# EAGLE design gigafoc (EAGLE 9.6.2)
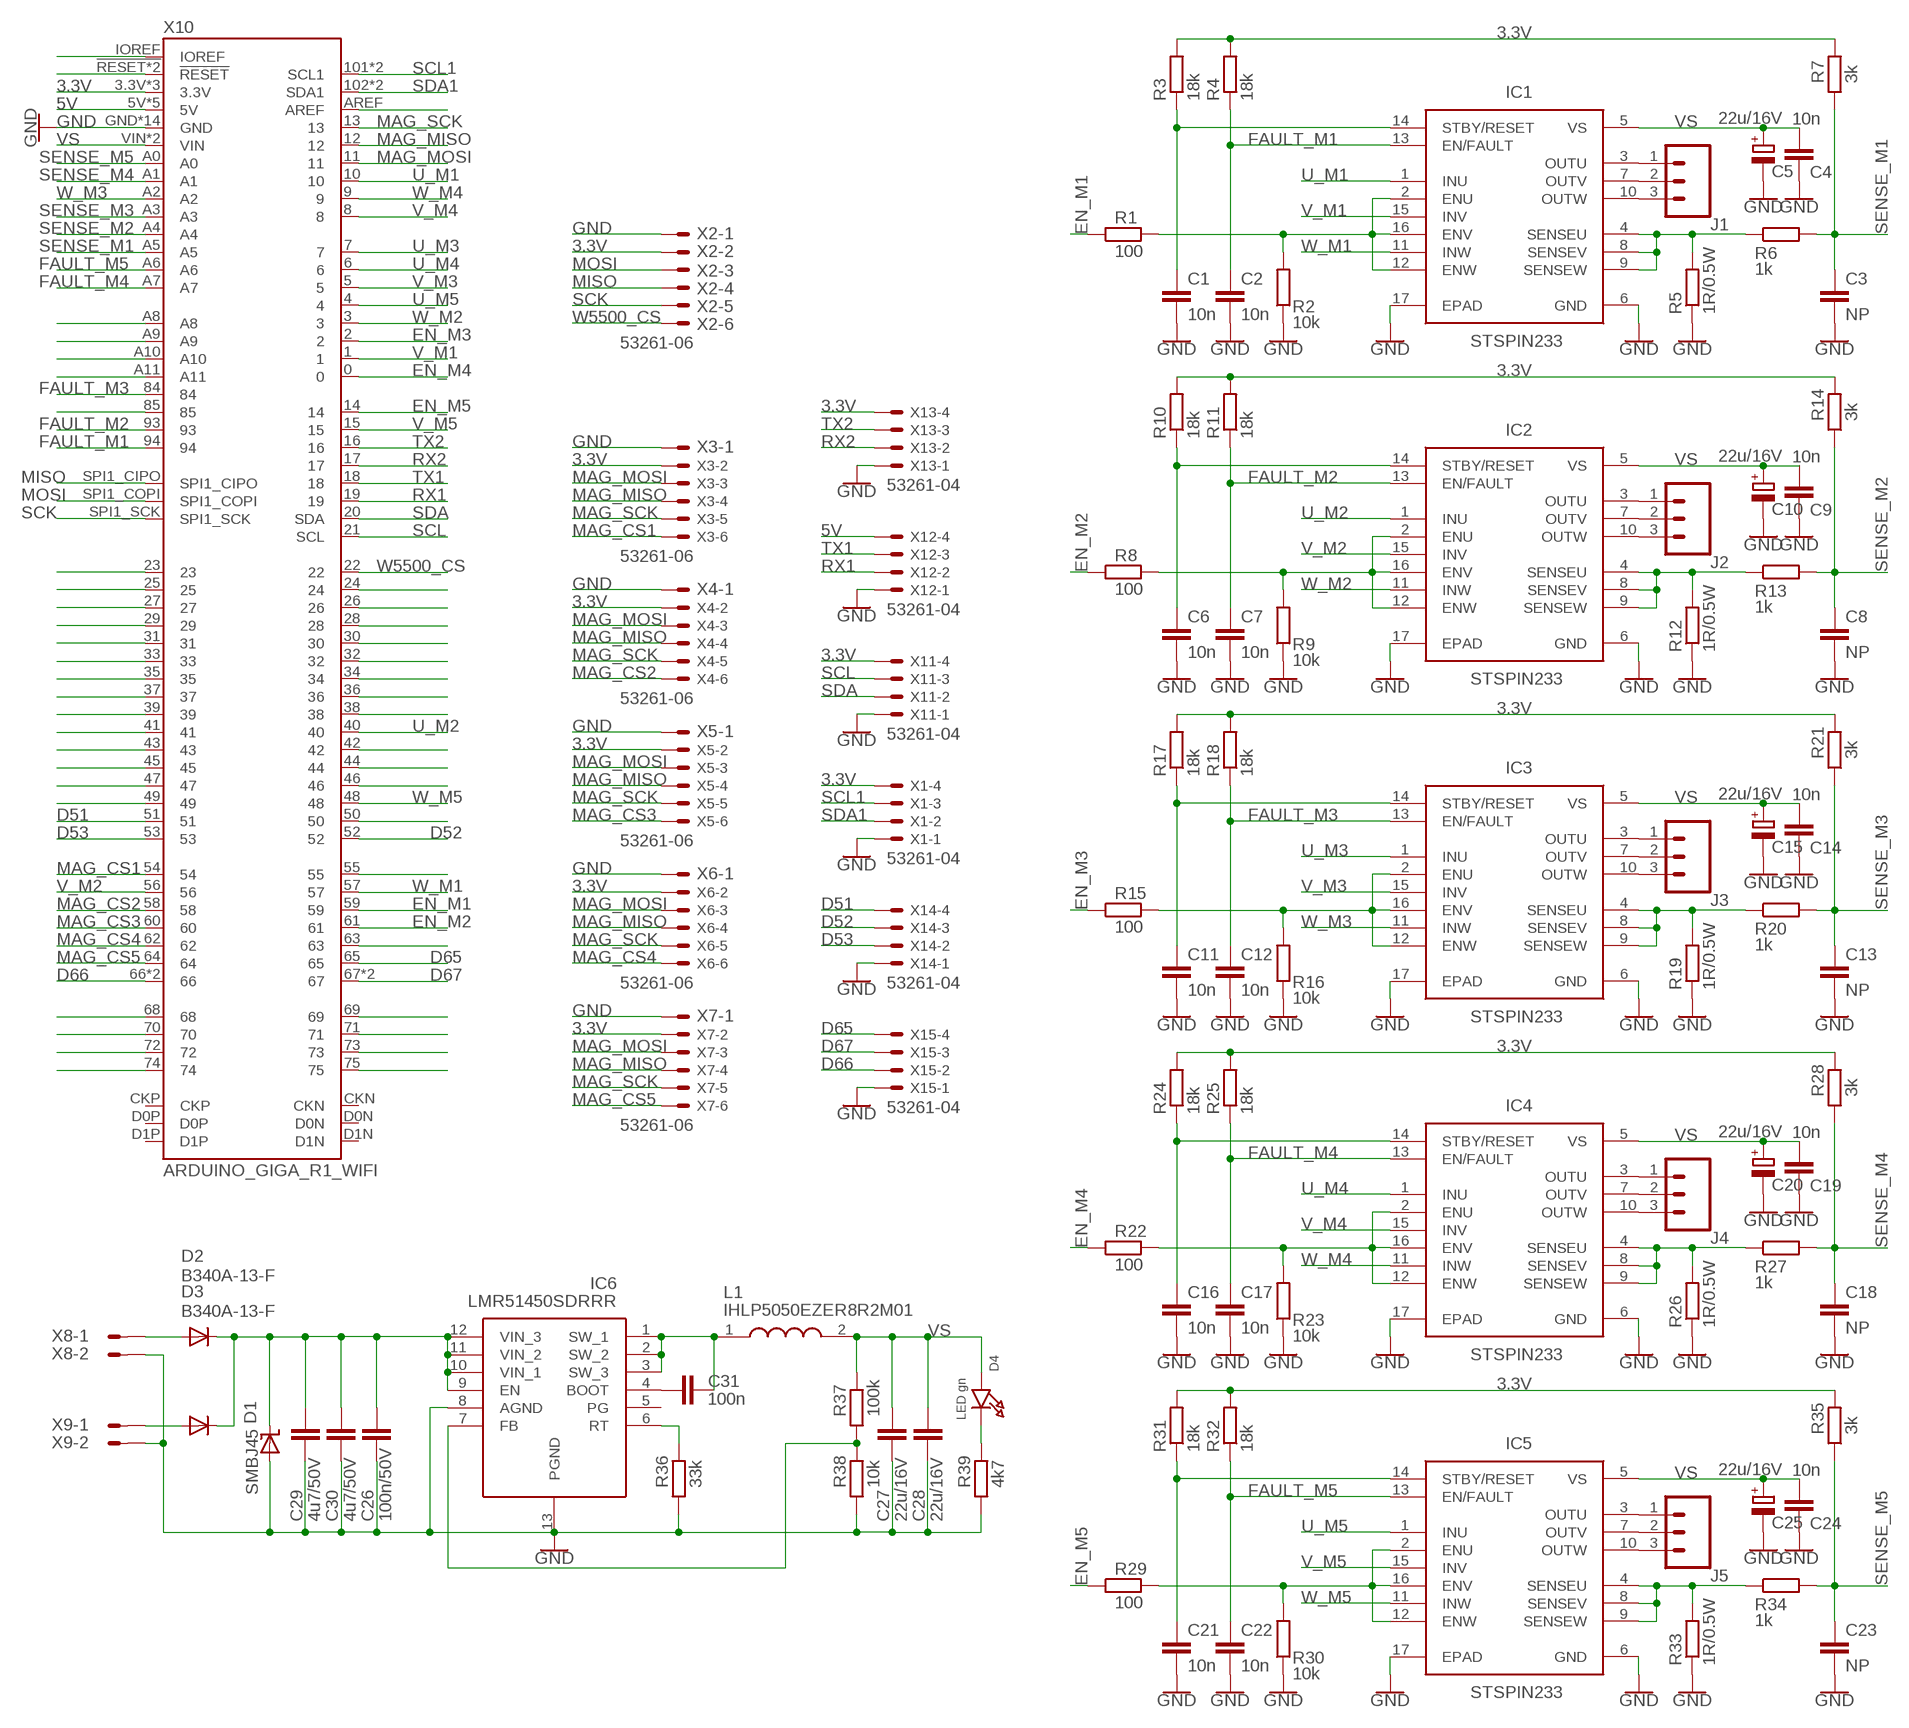
[diagram p0: schematic, sheet 1]

## Parts
C1  10n  C-EUC0603  [C0603]
C2  10n  C-EUC0603  [C0603]
C3  NP  C-EUC0603  [C0603]
C4  10n  C-EUC0603  [C0603]
C5  22u/16V  CPOL-EUSMCB  [SMC_B]
C6  10n  C-EUC0603  [C0603]
C7  10n  C-EUC0603  [C0603]
C8  NP  C-EUC0603  [C0603]
C9  10n  C-EUC0603  [C0603]
C10  22u/16V  CPOL-EUSMCB  [SMC_B]
C11  10n  C-EUC0603  [C0603]
C12  10n  C-EUC0603  [C0603]
C13  NP  C-EUC0603  [C0603]
C14  10n  C-EUC0603  [C0603]
C15  22u/16V  CPOL-EUSMCB  [SMC_B]
C16  10n  C-EUC0603  [C0603]
C17  10n  C-EUC0603  [C0603]
C18  NP  C-EUC0603  [C0603]
C19  10n  C-EUC0603  [C0603]
C20  22u/16V  CPOL-EUSMCB  [SMC_B]
C21  10n  C-EUC0603  [C0603]
C22  10n  C-EUC0603  [C0603]
C23  NP  C-EUC0603  [C0603]
C24  10n  C-EUC0603  [C0603]
C25  22u/16V  CPOL-EUSMCB  [SMC_B]
C26  100n/50V  C-EUC0805  [C0805]
C27  22u/16V  C-EUC1210  [C1210]
C28  22u/16V  C-EUC1210  [C1210]
C29  4u7/50V  C-EUC1210K  [C1210K]
C30  4u7/50V  C-EUC1210K  [C1210K]
C31  100n  C-EUC0603  [C0603]
D1  SMBJ45  SUPPRESSOR-SMBJ  [SMBJ]
D2  B340A-13-F  DIODE-DO214AC  [DO214AC]
D3  B340A-13-F  DIODE-DO214AC  [DO214AC]
D4  LED gn  LED0603_NOOUTLINE  [CHIPLED_0603_NOOUTLINE]
IC1  STSPIN233  [QFN50P300X300X100-17N]
IC2  STSPIN233  [QFN50P300X300X100-17N]
IC3  STSPIN233  [QFN50P300X300X100-17N]
IC4  STSPIN233  [QFN50P300X300X100-17N]
IC5  STSPIN233  [QFN50P300X300X100-17N]
IC6  LMR51450SDRRR  [SON50P300X300X80-13N]
J1  CONN_03POLAR  [MOLEX-1X3]
J2  CONN_03POLAR  [MOLEX-1X3]
J3  CONN_03POLAR  [MOLEX-1X3]
J4  CONN_03POLAR  [MOLEX-1X3]
J5  CONN_03POLAR  [MOLEX-1X3]
L1  IHLP5050EZER8R2M01  [INDPM132129X500N]
R1  100  R-EU_R0603  [R0603]
R2  10k  R-EU_R0603  [R0603]
R3  18k  R-EU_R0603  [R0603]
R4  18k  R-EU_R0603  [R0603]
R5  1R/0.5W  R-EU_R1206  [R1206]
R6  1k  R-EU_R0603  [R0603]
R7  3k  R-EU_R0603  [R0603]
R8  100  R-EU_R0603  [R0603]
R9  10k  R-EU_R0603  [R0603]
R10  18k  R-EU_R0603  [R0603]
R11  18k  R-EU_R0603  [R0603]
R12  1R/0.5W  R-EU_R1206  [R1206]
R13  1k  R-EU_R0603  [R0603]
R14  3k  R-EU_R0603  [R0603]
R15  100  R-EU_R0603  [R0603]
R16  10k  R-EU_R0603  [R0603]
R17  18k  R-EU_R0603  [R0603]
R18  18k  R-EU_R0603  [R0603]
R19  1R/0.5W  R-EU_R1206  [R1206]
R20  1k  R-EU_R0603  [R0603]
R21  3k  R-EU_R0603  [R0603]
R22  100  R-EU_R0603  [R0603]
R23  10k  R-EU_R0603  [R0603]
R24  18k  R-EU_R0603  [R0603]
R25  18k  R-EU_R0603  [R0603]
R26  1R/0.5W  R-EU_R1206  [R1206]
R27  1k  R-EU_R0603  [R0603]
R28  3k  R-EU_R0603  [R0603]
R29  100  R-EU_R0603  [R0603]
R30  10k  R-EU_R0603  [R0603]
R31  18k  R-EU_R0603  [R0603]
R32  18k  R-EU_R0603  [R0603]
R33  1R/0.5W  R-EU_R1206  [R1206]
R34  1k  R-EU_R0603  [R0603]
R35  3k  R-EU_R0603  [R0603]
R36  33k  R-EU_R0603  [R0603]
R37  100k  R-EU_R0603  [R0603]
R38  10k  R-EU_R0603  [R0603]
R39  4k7  R-EU_R0603  [R0603]
X1  53261-04  [53261-04]
X2  53261-06  [53261-06]
X3  53261-06  [53261-06]
X4  53261-06  [53261-06]
X5  53261-06  [53261-06]
X6  53261-06  [53261-06]
X7  53261-06  [53261-06]
X8  S02P  [S02P]
X9  S02P  [S02P]
X10  ARDUINO_GIGA_R1_WIFI  [ARDUINO_GIGA_NO_SILK]
X11  53261-04  [53261-04]
X12  53261-04  [53261-04]
X13  53261-04  [53261-04]
X14  53261-04  [53261-04]
X15  53261-04  [53261-04]

## Nets
3.3V: R3.2 R4.2 R7.2 R10.2 R11.2 R14.2 R17.2 R18.2 R21.2 R24.2 R25.2 R28.2 R31.2 R32.2 R35.2 X1.4 X2.2 X3.2 X4.2 X5.2 X6.2 X7.2 X10.3.3V X10.3.3V@1(3.3V) X10.3.3V@2(3.3V) X11.4 X13.4
5V: X10.5V X10.5V@1(5V) X10.5V@2(5V) X10.5V@3(5V) X10.5V@4(5V) X12.4
24V: D2.A X8.1
D51: X10.51 X14.4
D52: X10.52 X14.3
D53: X10.53 X14.2
D65: X10.65 X15.4
D66: X10.66 X10.66@1 X15.2
D67: X10.67 X10.67@1 X15.3
EN_M1: R1.1 X10.59
EN_M2: R8.1 X10.61
EN_M3: R15.1 X10.2
EN_M4: R22.1 X10.0
EN_M5: R29.1 X10.14
FAULT_M1: C2.2 IC1.13(EN/FAULT) R4.1 X10.94
FAULT_M2: C7.2 IC2.13(EN/FAULT) R11.1 X10.93
FAULT_M3: C12.2 IC3.13(EN/FAULT) R18.1 X10.84
FAULT_M4: C17.2 IC4.13(EN/FAULT) R25.1 X10.A7
FAULT_M5: C22.2 IC5.13(EN/FAULT) R32.1 X10.A6
GND [gnd]: C1.1 C2.1 C3.1 C4.1 C5.- C6.1 C7.1 C8.1 C9.1 C10.- C11.1 C12.1 C13.1 C14.1 C15.- C16.1 C17.1 C18.1 C19.1 C20.- C21.1 C22.1 C23.1 C24.1 C25.- C26.2 C27.2 C28.2 C29.2 C30.2 D1.A IC1.6(GND) IC1.17(EPAD) IC2.6(GND) IC2.17(EPAD) IC3.6(GND) IC3.17(EPAD) IC4.6(GND) IC4.17(EPAD) IC5.6(GND) IC5.17(EPAD) IC6.8(AGND) IC6.13(PGND) R2.1 R5.1 R9.1 R12.1 R16.1 R19.1 R23.1 R26.1 R30.1 R33.1 R36.1 R38.1 R39.1 X1.1 X2.1 X3.1 X4.1 X5.1 X6.1 X7.1 X8.2 X9.2 X10.GND X10.GND@1(GND) X10.GND@2(GND) X10.GND@3(GND) X10.GND@4(GND) X10.GND@5(GND) X10.GND@6(GND) X10.GND@7(GND) X10.GND@8(GND) X10.GND@9(GND) X10.GND@10(GND) X10.GND@11(GND) X10.GND@12(GND) X10.GND@13(GND) X11.1 X12.1 X13.1 X14.1 X15.1
MAG_CS1: X3.6 X10.54
MAG_CS2: X4.6 X10.58
MAG_CS3: X5.6 X10.60
MAG_CS4: X6.6 X10.62
MAG_CS5: X7.6 X10.64
MAG_MISO: X3.4 X4.4 X5.4 X6.4 X7.4 X10.12
MAG_MOSI: X3.3 X4.3 X5.3 X6.3 X7.3 X10.11
MAG_SCK: X3.5 X4.5 X5.5 X6.5 X7.5 X10.13
MISO: X2.4 X10.SPI1_CIPO
MOSI: X2.3 X10.SPI1_COPI
N$1: X10.75
N$2: X10.73
N$3: X10.71
N$4: X10.69
N$7: X10.63
N$10: X10.23
N$11: X10.55
N$13: X10.50
N$14: X10.25
N$15: X10.46
N$16: X10.44
N$17: X10.42
N$19: X10.74
N$20: X10.72
N$21: X10.70
N$22: X10.68
N$24: X10.24
N$25: X10.26
N$26: X10.27
N$27: X10.29
N$28: X10.31
N$29: X10.85
N$32: X10.49
N$33: X10.47
N$34: X10.45
N$35: X10.43
N$36: X10.41
N$37: X10.39
N$38: X10.37
N$39: X10.35
N$40: X10.33
N$41: IC1.2(ENU) IC1.12(ENW) IC1.16(ENV) R1.2 R2.2
N$42: C1.2 IC1.14(STBY/RESET) R3.1
N$43: IC1.4(SENSEU) IC1.8(SENSEV) IC1.9(SENSEW) R5.2 R6.1
N$44: X10.28
N$45: X10.30
N$46: X10.38
N$47: X10.36
N$48: X10.34
N$49: X10.32
N$50: C31.1 IC6.4(BOOT)
N$51: C31.2 IC6.1(SW_1) IC6.2(SW_2) IC6.3(SW_3) L1.1
N$52: IC1.3(OUTU) J1.1
N$53: IC1.7(OUTV) J1.2
N$54: IC1.10(OUTW) J1.3
N$58: D4.C R39.2
N$59: D3.A X9.1
N$60: IC6.7(FB) R37.1 R38.2
N$61: IC6.6(RT) R36.2
N$66: IC2.2(ENU) IC2.12(ENW) IC2.16(ENV) R8.2 R9.2
N$67: C6.2 IC2.14(STBY/RESET) R10.1
N$70: IC2.4(SENSEU) IC2.8(SENSEV) IC2.9(SENSEW) R12.2 R13.1
N$74: IC2.3(OUTU) J2.1
N$75: IC2.7(OUTV) J2.2
N$76: IC2.10(OUTW) J2.3
N$77: X10.AREF
N$83: X10.A11
N$84: X10.A10
N$85: X10.A9
N$86: X10.A8
N$92: IC3.2(ENU) IC3.12(ENW) IC3.16(ENV) R15.2 R16.2
N$95: C11.2 IC3.14(STBY/RESET) R17.1
N$99: IC3.4(SENSEU) IC3.8(SENSEV) IC3.9(SENSEW) R19.2 R20.1
N$102: X10.!RESET X10.RESET(!RESET)
N$103: X10.IOREF
N$105: IC3.3(OUTU) J3.1
N$106: IC3.7(OUTV) J3.2
N$107: IC3.10(OUTW) J3.3
N$110: IC4.2(ENU) IC4.12(ENW) IC4.16(ENV) R22.2 R23.2
N$111: C16.2 IC4.14(STBY/RESET) R24.1
N$114: IC4.4(SENSEU) IC4.8(SENSEV) IC4.9(SENSEW) R26.2 R27.1
N$118: IC4.3(OUTU) J4.1
N$119: IC4.7(OUTV) J4.2
N$120: IC4.10(OUTW) J4.3
N$123: IC5.2(ENU) IC5.12(ENW) IC5.16(ENV) R29.2 R30.2
N$124: C21.2 IC5.14(STBY/RESET) R31.1
N$127: IC5.4(SENSEU) IC5.8(SENSEV) IC5.9(SENSEW) R33.2 R34.1
N$131: IC5.3(OUTU) J5.1
N$132: IC5.7(OUTV) J5.2
N$133: IC5.10(OUTW) J5.3
RX1: X10.19 X12.2
RX2: X10.17 X13.2
SCK: X2.5 X10.SPI1_SCK
SCL: X10.21(SCL) X11.3
SCL1: X1.3 X10.101(SCL1) X10.101@1(SCL1)
SDA: X10.20(SDA) X11.2
SDA1: X1.2 X10.102(SDA1) X10.102@1(SDA1)
SENSE_M1: C3.2 R6.2 R7.1 X10.A5
SENSE_M2: C8.2 R13.2 R14.1 X10.A4
SENSE_M3: C13.2 R20.2 R21.1 X10.A3
SENSE_M4: C18.2 R27.2 R28.1 X10.A1
SENSE_M5: C23.2 R34.2 R35.1 X10.A0
TX1: X10.18 X12.3
TX2: X10.16 X13.3
U_M1: IC1.1(INU) X10.10
U_M2: IC2.1(INU) X10.40
U_M3: IC3.1(INU) X10.7
U_M4: IC4.1(INU) X10.6
U_M5: IC5.1(INU) X10.4
V_M1: IC1.15(INV) X10.1
V_M2: IC2.15(INV) X10.56
V_M3: IC3.15(INV) X10.5
V_M4: IC4.15(INV) X10.8
V_M5: IC5.15(INV) X10.15
VIN: C26.1 C29.1 C30.1 D1.C D2.C D3.C IC6.9(EN) IC6.10(VIN_1) IC6.11(VIN_2) IC6.12(VIN_3)
VS: C4.2 C5.+ C9.2 C10.+ C14.2 C15.+ C19.2 C20.+ C24.2 C25.+ C27.1 C28.1 D4.A IC1.5(VS) IC2.5(VS) IC3.5(VS) IC4.5(VS) IC5.5(VS) L1.2 R37.2 X10.VIN X10.VIN@1(VIN)
W5500_CS: X2.6 X10.22
W_M1: IC1.11(INW) X10.57
W_M2: IC2.11(INW) X10.3
W_M3: IC3.11(INW) X10.A2
W_M4: IC4.11(INW) X10.9
W_M5: IC5.11(INW) X10.48
Unconnected: IC6.5(PG) X10.CKN X10.CKP X10.D0N X10.D0P X10.D1N X10.D1P

## Library data of the parts
C1-C4 C6-C9 C11-C14 C16-C19 C21-C24 C26-C31 = resistor:C-EU: CAPACITOR, European symbol
C5 C10 C15 C20 C25 = resistor:CPOL-EU: POLARIZED CAPACITOR, European symbol
D1 = diode:SUPPRESSOR-: Suppressor diode
D2 D3 = diode:DIODE-: DIODE
D4 = microbuilder:LED: LED 0603 - 0603 Surface Mount Package 2mA: Green LED - Low Power (3.9mcd, 2ma, 1.7Vf) - Digikey: 475-2709-2-ND Orange LED - Low Power (9.8mcd, 2ma, 1.8Vf) - Digikey: 475-1194-2-ND Red LED - Low Power (5mcd, 2ma, 1.8Vf) - Digikey: 475-1195-2-ND Yellow LED - Low Power (7mcd, 2ma, 1.8Vf) - Digikey: 475-1196-2-ND 5mA: Blue LED - Low Power (17mcd, 5ma, 2.9Vf) - Digikey: LNJ937W8CRACT-ND 0805 - 0805 Surface Mount Package 2mA: Red LED (8.8mcd, 2mA, 1.8Vf, Clear) - Low Power [Digikey: 475-2510-1-ND] Green LED (5mcd, 2mA, 1.8Vf, Clear) - Low Power [Digikey: 475-2730-1-ND] Yellow LED (11.3mcd, 2mA, 1.8Vf, Clear) - Low Power [Digikey: 475-2555-1-ND] 20mA: Red LED (104mcd, 20mA, Diffused) - LS R976 [Digikey: 475-1278-6-ND] Red LED (12mcd, 20mA, 2.0Vf, Clear) - APT2012EC [Digikey: 754-1128-1-ND] Green LED (15mcd, 20mA, 2.2Vf, Clear) - APT2012GC [Digikey: 754-1131-1-ND] Orange LED (160mcd, 20mA, 2.1Vf, Clear) - APT2012SECK [Digikey: 754-1130-1-ND] 1206 - 1206 Surface Mount Package Green LED (26mcd, 20mA, Diffused) - LG N971 [Digikey: 475-1407-6-ND] Red LED (15mcd, 20mA, Diffused) - LH N974 [Digikey: 475-1416-6-ND] Cree - Cree High-Power Surface Mount LEDs XPEBWT-L1-0000-00D50 - White 111lm 350mA 2.9Vf 6200K 110° XTEAWT-00-0000-00000LEE3 - White 114lm 350mA 2.85Vf 5000K 115° Everlight - Everlight 45-21 Series Surface Mount LEDs 45-21/QK2C-B2832AC2CB2/2T - Warm White 2000mcd 20mA 3.25Vf 3050K 120° 45-21/LK2C-B38452C4CB2/2T - Nuetral White 2000mcd 20mA 3.25Vf 4150K 120° 45-21/LK2C-B50634C6CB2/2T - Cold White 2200mcd 20mA 3.25Vf 5650K 120° PLCC2 Reverse Mount LS T77K-J1L2-1-0-2-R18-Z - Red 11.25mcd 2mA 1.8Vf 630nm 120° LO T77K-L1M2-24-Z - Orange 19.6mcd 2mA 1.8Vf 606nm 120° LY T77K-K2M1-26-Z - Yellow 15.7mcd 2mA 1.8Vf 587nm 120°
IC1-IC5 = STSPIN233:STSPIN233: Motor / Motion / Ignition Controllers & Drivers Source: Datasheet; DESCRIPTION: Motor / Motion / Ignition Controllers & Drivers; HEIGHT: 1mm; MANUFACTURER_NAME: STMicroelectronics; MANUFACTURER_PART_NUMBER: STSPIN233; MOUSER_PART_NUMBER: 511-STSPIN233; MOUSER_PRICE-STOCK: https://www.mouser.co.uk/ProductDetail/STMicroelectronics/STSPIN233?qs=r5DSvlrkXmLXV%2FIVTKgcRQ%3D%3D
IC6 = LMR51450SDRRR:LMR51450SDRRR: Switching Voltage Regulators 36-V, 5-A synchronous buck converter Source: Datasheet <https://www.ti.com/lit/ds/symlink/lmr51450.pdf?ts=1695888951673&ref_url=https%3A%2F%2Fwww.ti.com%2Fproduct%2FLMR51450%2Fpart-details%2FLMR51450SDRRR>; DESCRIPTION: Switching Voltage Regulators 36-V, 5-A synchronous buck converter; HEIGHT: 0.8mm; MANUFACTURER_NAME: Texas Instruments; MANUFACTURER_PART_NUMBER: LMR51450SDRRR; MOUSER_PART_NUMBER: 595-LMR51450SDRRR; MOUSER_PRICE-STOCK: https://www.mouser.co.uk/ProductDetail/Texas-Instruments/LMR51450SDRRR?qs=rQFj71Wb1eUvKinsjoLiUA%3D%3D
J1-J5 = SparkFun-Connectors:CONN_03: Multi connection point. Often used as Generic Header-pin footprint for 0.1 inch spaced/style header connections On any of the 0.1 inch spaced packages, you can populate with these: Break Away Headers - Straight <https://www.sparkfun.com/products/116> (PRT-00116) Break Away Male Headers - Right Angle <https://www.sparkfun.com/products/553> (PRT-00553) Female Headers <https://www.sparkfun.com/products/115> (PRT-00115) Break Away Headers - Machine Pin <https://www.sparkfun.com/products/117> (PRT-00117) Break Away Female Headers - Swiss Machine Pin <https://www.sparkfun.com/products/743> (PRT-00743) Stackable Header - 3 Pin (Female, 0.1") <https://www.sparkfun.com/products/13875> (PRT-13875) For SCREWTERMINALS and SPRING TERMINALS visit here: Screw Terimnals on SparkFun.com <https://www.sparkfun.com/search/results?term=Screw+Terminals> (5mm/3.5mm/2.54mm spacing) This device is also useful as a general connection point to wire up your design to another part of your project. Our various solder wires solder well into these plated through hole pads. Hook-Up Wire - Assortment (Stranded, 22 AWG) <https://www.sparkfun.com/products/11375> (PRT-11375) Hook-Up Wire - Assortment (Solid Core, 22 AWG) <https://www.sparkfun.com/products/11367> (PRT-11367) View the entire wire category on our website here <https://www.sparkfun.com/categories/141> Special notes: Molex polarized connector foot print use with SKU : PRT-08232 with associated crimp pins and housings.; PROD_ID: CONN-08625; SF_ID: PRT-08096
L1 = IHLP5050EZER8R2M01:IHLP5050EZER8R2M01: Vishay IHLP-5050EZ-01 Series Type 5050 Shielded Wire-wound SMD Inductor with a Metal Composite Core, 8.2 H +/-20% Source: Datasheet <https://www.arrow.com/en/products/ihlp5050ezer8r2m01/vishay>; DESCRIPTION: Vishay IHLP-5050EZ-01 Series Type 5050 Shielded Wire-wound SMD Inductor with a Metal Composite Core, 8.2 H +/-20%; HEIGHT: 5mm; MANUFACTURER_NAME: Vishay; MANUFACTURER_PART_NUMBER: IHLP5050EZER8R2M01; MOUSER_PART_NUMBER: 70-IHLP5050EZER8R2M1; MOUSER_PRICE-STOCK: https://www.mouser.co.uk/ProductDetail/Vishay-Dale/IHLP5050EZER8R2M01?qs=uaOZrBdDwWX6YC18m3B%2Flg%3D%3D
R1-R39 = resistor:R-EU_: RESISTOR, European symbol
X1 X11-X15 = con-molex:53?-04: CONNECTOR wire to board 1.25 mm (.049 inch) pitch header; MF: MOLEX; OC_FARNELL: 1125374; OC_NEWARK: unknown
X2-X7 = con-molex:53?-06: CONNECTOR wire to board 1.25 mm (.049 inch) pitch header; MF: MOLEX; OC_FARNELL: 1125375; OC_NEWARK: unknown
X8 X9 = con-amp-mt:S02P: AMP MT CONNECTOR; OC_FARNELL: unknown; OC_NEWARK: unknown
X10 = SparkFun-Boards:ARDUINO_GIGA_R1_WIFI

## Board
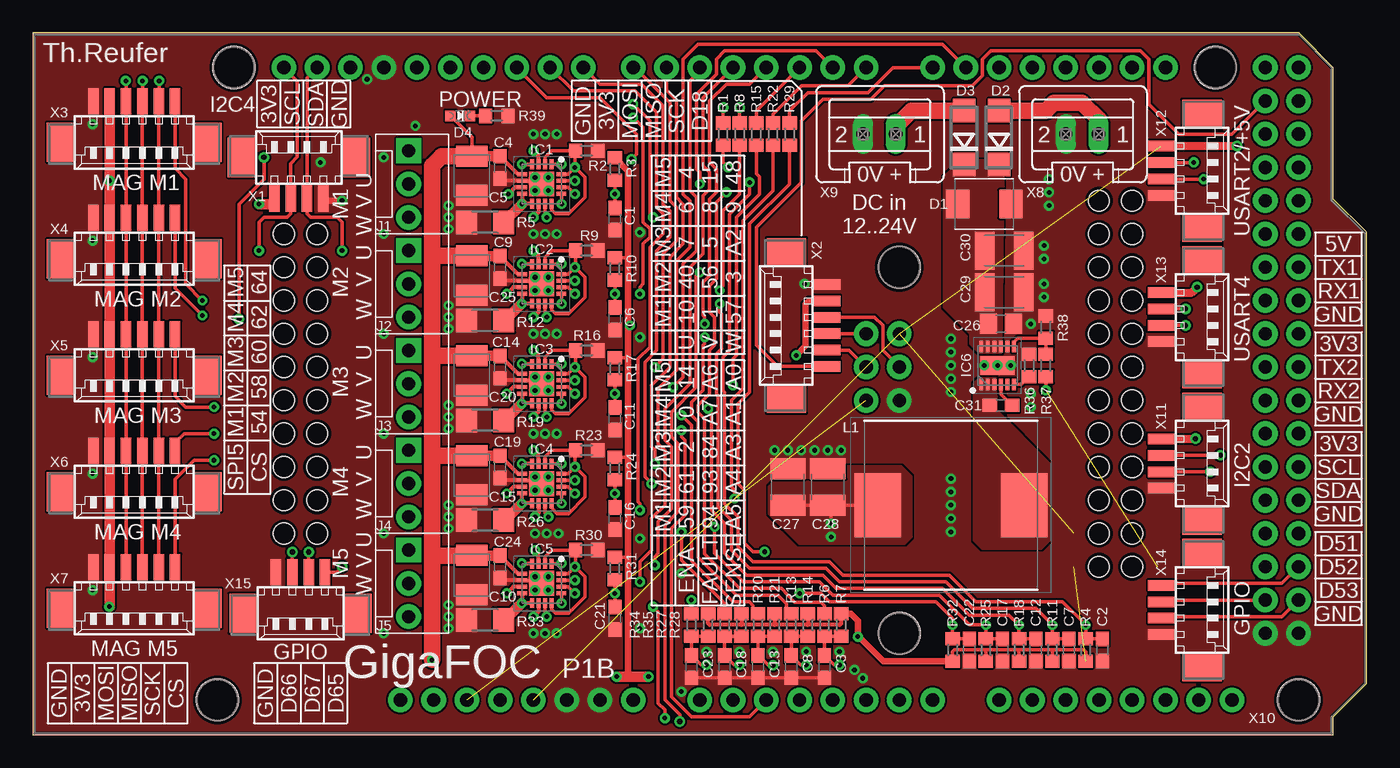
[diagram p1: board, top side]
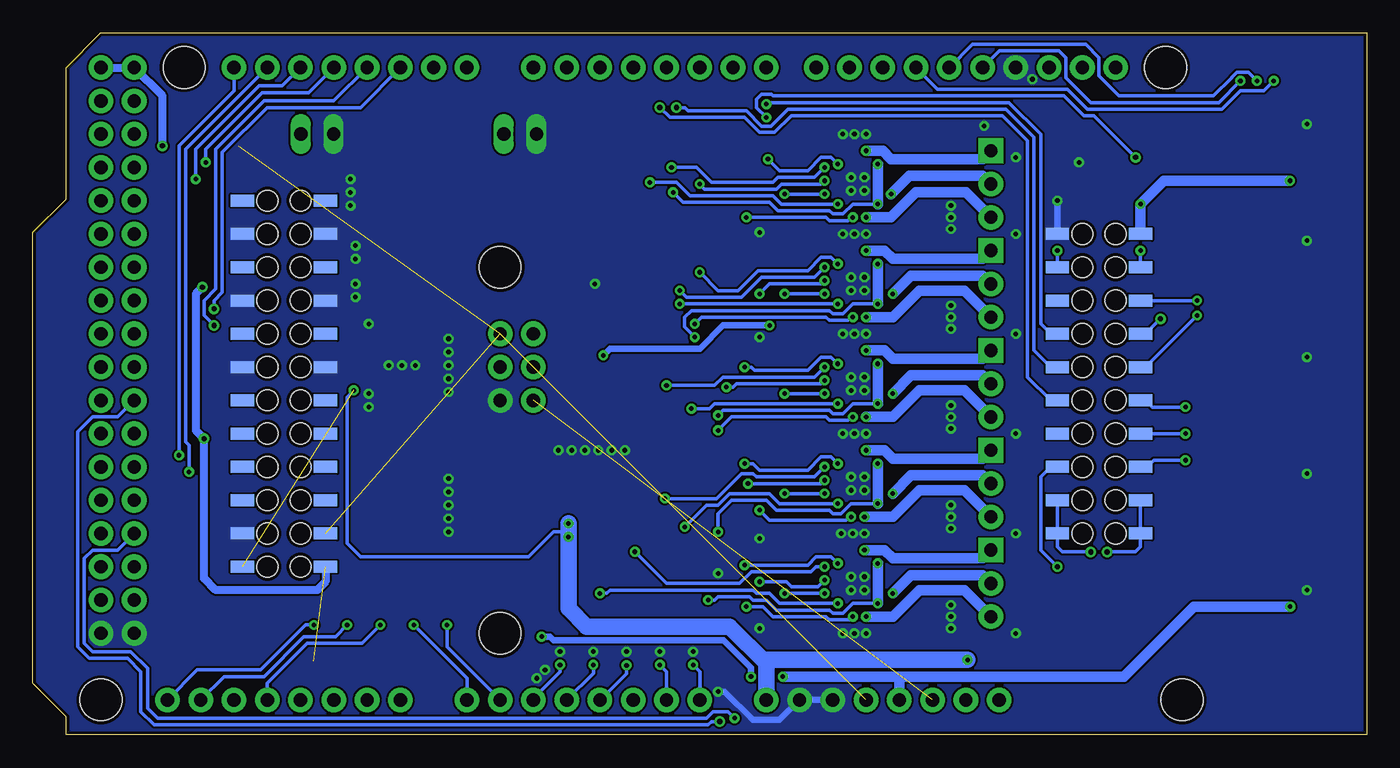
[diagram p2: board, bottom side, seen from below]

Size 101.85 x 53.58 mm. Coordinates in mm from the lower left corner, seen from the top.
Outline: 0,0 99.31,0 99.31,1.4 101.85,3.94 101.85,38.35 99.31,40.89 99.31,50.93 96.7,53.54 96.7,53.58 0,53.58 0,0
Copper layers (1*16): Top 0.035mm / dielectric 1.5mm / Bottom 0.035mm
Design rules "default *": minimum track width 6mil, minimum drill 0.35mm, track to track 6mil, track to pad 6mil, pad to pad 6mil, via to via 6mil, smd to smd 6mil, copper to edge 10mil, drill to drill 6mil, minimum pad ring 10mil, minimum via ring 8mil, stop-mask expansion 4mil, vias tented up to drill 15mil, thermal gap 10mil

### Footprints (pad centres in the part's own frame; a part is rotated, then mirrored left to right if it is on the bottom)
C0603 = smd 1.1 x 1: 1 -0.85,0; 2 0.85,0
SMC_B = smd 1.6 x 2.4: + -1.5,0; - 1.5,0
C0805 = smd 1.3 x 1.5: 1 -0.95,0; 2 0.95,0
C1210 = smd 1.6 x 2.7: 1 -1.4,0; 2 1.4,0
C1210K = smd 1.5 x 2.9: 1 -1.5,0; 2 1.5,0
SMBJ = smd 1.78 x 2.16: A 2.04,0; C -2.03,0
DO214AC = smd 1.8 x 1.7: A 2.05,0; C -2.05,0
CHIPLED_0603_NOOUTLINE = smd 0.8 x 0.8: A 0,-0.75; C 0,0.75
QFN50P300X300X100-17N = smd 0.75 x 0.3: 1 -1.5,0.75; 2 -1.5,0.25; 3 -1.5,-0.25; 4 -1.5,-0.75; 9 1.5,-0.75; 10 1.5,-0.25; 11 1.5,0.25; 12 1.5,0.75 | smd 0.3 x 0.75: 5 -0.75,-1.5; 6 -0.25,-1.5; 7 0.25,-1.5; 8 0.75,-1.5; 13 0.75,1.5; 14 0.25,1.5; 15 -0.25,1.5; 16 -0.75,1.5 | smd 1.9 x 1.9: 17 0,0
SON50P300X300X80-13N = smd 0.9 x 0.3: 1 -1.45,1.25; 2 -1.45,0.75; 3 -1.45,0.25; 4 -1.45,-0.25; 5 -1.45,-0.75; 6 -1.45,-1.25; 7 1.45,-1.25; 8 1.45,-0.75; 9 1.45,-0.25; 10 1.45,0.25; 11 1.45,0.75; 12 1.45,1.25 | smd 1.4 x 2.6: 13 0,0
MOLEX-1X3 = drill 1.016 pad 1.88 square: 1 0,0 | drill 1.016 pad 1.88: 2 2.54,0; 3 5.08,0
INDPM132129X500N = smd 3.55 x 4.9: 1 -5.6,0; 2 5.6,0
R0603 = smd 1 x 1.1: 1 -0.85,0; 2 0.85,0
R1206 = smd 1.6 x 1.803: 1 -1.422,0; 2 1.422,0
53261-04 = smd 0.8 x 2: 1 1.875,-2.5; 2 0.625,-2.5; 3 -0.625,-2.5; 4 -1.875,-2.5 | smd 2.1 x 3: S1 4.375,0.625; S2 -4.375,0.625
53261-06 = smd 0.8 x 2: 1 3.125,-2.5; 2 1.875,-2.5; 3 0.625,-2.5; 4 -0.625,-2.5; 5 -1.875,-2.5; 6 -3.125,-2.5 | smd 2.1 x 3: S1 5.625,0.625; S2 -5.625,0.625
S02P = drill 1.016 long: 1 1.25,0; 2 -1.25,0
ARDUINO_GIGA_NO_SILK = drill 1.016 pad 1.88: 0 13.97,24.13; 1 11.43,24.13; 2 8.89,24.13; 3 6.35,24.13; 3.3V -13.97,-24.13; 4 3.81,24.13; 5 1.27,24.13; 5V -11.43,-24.13; 5V@1 44.45,24.13; 5V@2 46.99,24.13; 5V@3 16.51,3.81; 6 -1.27,24.13; 7 -3.81,24.13; 8 -7.62,24.13; 9 -10.16,24.13; 10 -12.7,24.13; 11 -15.24,24.13; 12 -17.78,24.13; 13 -20.32,24.13; 14 19.05,24.13; 15 21.59,24.13; 16 24.13,24.13; 17 26.67,24.13; 18 29.21,24.13; 19 31.75,24.13; 20 34.29,24.13; 21 36.83,24.13; 22 44.45,21.59; 23 46.99,21.59; 24 44.45,19.05; 25 46.99,19.05; 26 44.45,16.51; 27 46.99,16.51; 28 44.45,13.97; 29 46.99,13.97; 30 44.45,11.43; 31 46.99,11.43; 32 44.45,8.89; 33 46.99,8.89; 34 44.45,6.35; 35 46.99,6.35; 36 44.45,3.81; 37 46.99,3.81; 38 44.45,1.27; 39 46.99,1.27; 40 44.45,-1.27; 41 46.99,-1.27; 42 44.45,-3.81; 43 46.99,-3.81; 44 44.45,-6.35; 45 46.99,-6.35; 46 44.45,-8.89; 47 46.99,-8.89; 48 44.45,-11.43; 49 46.99,-11.43; 50 44.45,-13.97; 51 46.99,-13.97; 52 44.45,-16.51; 53 46.99,-16.51; 84 34.29,-24.13; 85 36.83,-24.13; 93 39.37,-24.13; 94 41.91,-24.13; 101 -30.48,24.13; 102 -27.94,24.13; !RESET 13.97,-1.27; A0 1.27,-24.13; A1 3.81,-24.13; A2 6.35,-24.13; A3 8.89,-24.13; A4 11.43,-24.13; A5 13.97,-24.13; A6 16.51,-24.13; A7 19.05,-24.13; A8 24.13,-24.13; A9 26.67,-24.13; A10 29.21,-24.13; A11 31.75,-24.13; AREF -25.4,24.13; GND -8.89,-24.13; GND@1 -6.35,-24.13; GND@2 44.45,-19.05; GND@3 46.99,-19.05; GND@4 -22.86,24.13; GND@5 16.51,-1.27; IOREF -19.05,-24.13; NC -21.59,-24.13; RESET -16.51,-24.13; SPI1_CIPO 13.97,3.81; SPI1_COPI 16.51,1.27; SPI1_SCK 13.97,1.27; VIN -3.81,-24.13 | smd 1.778 x 0.914 bottom: 3.3V@1 29.845,-13.97; 3.3V@2 -32.385,11.43; 5V@4 29.845,-11.43; 54 -32.385,6.35; 55 -26.035,6.35; 56 -32.385,3.81; 57 -26.035,3.81; 58 -32.385,1.27; 59 -26.035,1.27; 60 -32.385,-1.27; 61 -26.035,-1.27; 62 -32.385,-3.81; 63 -26.035,-3.81; 64 -32.385,-6.35; 65 -26.035,-6.35; 66 -32.385,-8.89; 66@1 -32.385,-11.43; 67 -26.035,-8.89; 67@1 -26.035,-11.43; 68 29.845,-1.27; 69 36.195,-1.27; 70 29.845,-3.81; 71 36.195,-3.81; 72 29.845,-6.35; 73 36.195,-6.35; 74 29.845,-8.89; 75 36.195,-8.89; 101@1 -32.385,8.89; 102@1 -26.035,8.89; CKN 29.845,8.89; CKP 36.195,8.89; D0N 29.845,3.81; D0P 36.195,3.81; D1N 29.845,13.97; D1P 36.195,13.97; GND@6 36.195,-11.43; GND@7 36.195,1.27; GND@8 36.195,6.35; GND@9 36.195,11.43; GND@10 29.845,11.43; GND@11 29.845,6.35; GND@12 29.845,1.27; GND@13 -26.035,11.43; VIN@1 36.195,-13.97 | hole 1.6: 34.29,13.97; 34.29,11.43; 34.29,8.89; 34.29,6.35; 34.29,3.81; 34.29,1.27; 34.29,-1.27; 34.29,-3.81; 34.29,-6.35; 34.29,-8.89; 34.29,-11.43; 34.29,-13.97; 31.75,-13.97; 31.75,-11.43; 31.75,-8.89; 31.75,-6.35; 31.75,-3.81; 31.75,-1.27; 31.75,1.27; 31.75,3.81; 31.75,6.35; 31.75,8.89; 31.75,11.43; 31.75,13.97; -30.48,11.43; -30.48,8.89; -30.48,6.35; -30.48,3.81; -30.48,1.27; -30.48,-1.27; -30.48,-3.81; -30.48,-6.35; -30.48,-8.89; -30.48,-11.43; -27.94,11.43; -27.94,8.89; -27.94,6.35; -27.94,3.81; -27.94,1.27; -27.94,-1.27; -27.94,-3.81; -27.94,-6.35; -27.94,-8.89; -27.94,-11.43 | hole 3.2: -34.29,24.13; -35.56,-24.13; 46.99,-24.13; 40.64,24.13; 16.51,8.89; 16.51,-19.05

### Placement (x,y rotation side)
C1  44.45,39.37 90 top
C2  81.66,6.48 90 top
C3  60.45,5.21 90 top
C4  35.69,43.31 90 top
C5  33.53,42.67 270 top
C6  44.45,31.75 90 top
C7  79.12,6.48 90 top
C8  57.91,5.21 90 top
C9  35.69,35.69 90 top
C10  33.53,12.19 270 top
C11  44.45,24.13 90 top
C12  76.58,6.48 90 top
C13  55.37,5.21 90 top
C14  35.69,28.07 90 top
C15  33.53,19.81 270 top
C16  44.45,16.51 90 top
C17  74.04,6.48 90 top
C18  52.83,5.21 90 top
C19  35.69,20.45 90 top
C20  33.53,27.43 270 top
C21  44.45,8.89 90 top
C22  71.5,6.48 90 top
C23  50.29,5.21 90 top
C24  35.69,12.83 90 top
C25  33.53,35.05 270 top
C26  73.91,31.37 0 top
C27  57.66,18.92 90 top
C28  60.71,18.92 90 top
C29  74.17,33.78 0 top
C30  74.17,36.96 0 top
C31  73.91,25.15 180 top
D1  72.64,40.51 0 top
D2  73.79,45.59 90 top
D3  71.12,45.59 90 top
D4  32.64,47.24 270 top
IC1  38.86,42.04 270 top
IC2  38.86,34.42 270 top
IC3  38.86,26.8 270 top
IC4  38.86,19.18 270 top
IC5  38.86,11.56 270 top
IC6  73.66,28.19 90 top
J1  28.7,44.58 270 top
J2  28.7,36.96 270 top
J3  28.7,29.34 270 top
J4  28.7,21.72 270 top
J5  28.7,14.1 270 top
L1  70.1,17.53 180 top
R1  52.71,45.85 270 top
R2  42.29,44.58 180 top
R3  44.45,43.18 90 top
R4  80.39,6.48 270 top
R5  34.54,39.12 0 top
R6  60.45,8.38 270 top
R7  61.72,8.38 90 top
R8  53.98,45.85 270 top
R9  42.29,36.96 180 top
R10  44.45,35.56 90 top
R11  77.85,6.48 270 top
R12  34.54,31.62 0 top
R13  57.91,8.38 270 top
R14  59.18,8.38 90 top
R15  55.25,45.85 270 top
R16  42.29,29.34 180 top
R17  44.45,27.94 90 top
R18  75.31,6.48 270 top
R19  34.54,24 0 top
R20  55.37,8.38 270 top
R21  56.64,8.38 90 top
R22  56.52,45.85 270 top
R23  42.29,21.72 180 top
R24  44.45,20.32 90 top
R25  72.77,6.48 270 top
R26  34.54,16.38 0 top
R27  52.83,8.38 270 top
R28  54.1,8.38 90 top
R29  57.79,45.85 270 top
R30  42.29,14.1 180 top
R31  44.45,12.7 90 top
R32  70.23,6.48 270 top
R33  34.54,8.76 0 top
R34  50.29,8.38 270 top
R35  51.56,8.38 90 top
R36  76.07,28.19 270 top
R37  77.34,28.19 270 top
R38  77.34,31.12 270 top
R39  35.43,47.24 180 top
X1  20.32,43.43 0 top
X2  58.17,31.24 90 top
X3  7.75,45.85 180 top
X4  7.75,36.96 180 top
X5  7.75,28.07 180 top
X6  7.75,19.18 180 top
X7  7.75,10.29 180 top
X8  80.14,45.85 0 top
X9  64.64,45.85 0 top
X10  49.66,26.8 0 top
X11  88.65,20.7 270 top
X12  88.65,43.05 270 top
X13  88.65,31.88 270 top
X14  88.65,9.52 270 top
X15  20.45,9.91 180 top

### Tracks (layer width: path | path; a pad name or v marks a point on that pad's centre or on a via)
3.3V  (via drill 0.35, 0.39)  (1 unrouted)
  Top 0.254: R31.2 45.47,13.55 | R32.2 70.23,6.35 70.36,6.48 72.77,6.48 | 72.77,6.48 75.31,6.48 | 75.31,6.48 77.85,6.48 | 77.85,6.48 80.26,6.48 80.39,6.35 R4.2 | R11.2 77.85,6.48 | R18.2 75.31,6.48 | R25.2 72.77,6.48 | R3.2 44.62,44.03 | R24.2 45.43,21.17 45.47,21.21 | R10.2 45.47,36.41 45.47,31.37 v45.59,31.24 | R17.2 45.43,28.79 45.47,28.83
  Top 0.305: R7.2 61.72,8.51 61.6,8.38 59.18,8.38 | R35.2 51.56,8.51 51.69,8.38 54.1,8.38 | 59.18,8.38 56.64,8.38 | 56.64,8.38 54.1,8.38 | R28.2 54.1,8.38 | R21.2 56.64,8.38 | R14.2 59.18,8.38
  Top 0.508: R32.2 64.95,5.63 63.08,7.49 v62.99,7.49 62.99,8.72 62.48,9.23 R7.2 | X2.2 59.27,33.12 59.02,32.86 59.02,29.68 v58.29,28.96 | R3.2 45.47,43.01 45.47,31.12 | v45.59,31.24 45.47,31.12 | 45.47,31.12 45.47,28.83 45.47,21.21 45.47,13.55 45.47,4.44
  Top 0.61: v88.77,22.61 88.74,22.58 X11.4 | X13.4 88.49,33.75 v88.9,34.16
  Top 0.813: X1.4 18.45,40.67 18.29,40.51 v17.27,40.51 | v5.84,9.78 5.87,9.78 X7.2 X6.2 X5.2 X4.2 v5.87,42.29 X3.2 | v47.01,4.44 45.47,4.44 v44.58,4.44
  Bottom 0.508: v45.59,31.24 49.15,31.24 50.93,29.46 57.79,29.46 v58.29,28.96 | v62.99,7.49 62.36,7.49 62.08,7.21 49.12,7.21 47.01,5.1 v47.01,4.44
  Bottom 0.61: X10.3.3V@1 79.5,11.68 80.14,11.05 87.88,11.05 88.77,11.94 v88.77,22.61 89.41,23.24 89.41,33.66 v88.9,34.16
  Bottom 0.813: v44.58,4.44 35.69,4.44 | 35.69,4.44 X10.3.3V | X10.3.3V@2 v17.27,40.51 15.49,42.29 v5.87,42.29 | 35.69,4.44 18.54,4.44 13.21,9.78 v5.84,9.78
5V  (via drill 0.39)  (3 unrouted)
  Top 0.61: v91.95,44.96 91.92,44.93 X12.4
  Bottom 0.61: X10.5V@2 X10.5V@1 91.95,48.77 v91.95,44.96
24V
  Top 1.27: D2.A 77.36,47.64 77.98,48.26 80.12,48.26 81.39,46.99 X8.1
D51
  Top 0.254: X10.51 95.38,11.56 86.3,11.56 X14.4
D52
  Top 0.254: X10.52 86.28,10.29 X14.3
D53
  Top 0.254: X10.53 95.38,9.02 86.26,9.02 X14.2
D65  (via drill 0.39)
  Top 0.254: X15.4 23.2,12.41 v23.62,12.83
  Bottom 0.254: v23.62,12.83 24.89,14.1 24.89,19.69 24.13,20.45 X10.65
D66  (via drill 0.39)
  Top 0.254: X15.2 v19.82,13.96 | v19.82,13.96 19.81,13.97 | v19.82,13.96
  Bottom 0.254: X10.66 X10.66@1 17.27,14.35 17.66,13.96 v19.82,13.96
D67  (via drill 0.39)
  Top 0.254: X15.3 v21.07,13.96 | v21.07,13.96 21.08,13.97 | v21.07,13.96
  Bottom 0.254: X10.67 X10.67@1 23.62,14.35 23.24,13.97 22.35,13.97 22.34,13.96 v21.07,13.96
EN_M1  (via drill 0.39)
  Top 0.254: R1.1 v52.71,47.88
  Bottom 0.254: X10.59 24.13,28.07 25.4,29.34 25.4,45.59 27.56,47.75 44.2,47.75 45.49,46.46 46.21,46.46 47.37,47.62 51.82,47.62 52.07,47.88 v52.71,47.88
EN_M2  (via drill 0.39)
  Top 0.254: R8.1 v53.98,47.88
  Bottom 0.254: X10.61 24.13,25.53 25.91,27.3 25.91,45.34 27.81,47.24 43.94,47.24 45.21,45.97 46.36,45.97 47.5,47.12 53.21,47.12 v53.98,47.88
EN_M3
  Top 0.254: X10.2 55.25,47.62 R15.1
EN_M4
  Top 0.254: R22.1 56.52,47.37 58.67,49.53 62.23,49.53 X10.0
EN_M5
  Top 0.254: R29.1 57.79,47.62 59.18,49.02 63.75,49.02 65.66,50.93 X10.14
FAULT_M1  (via drill 0.35)
  Top 0.254: 40.39,41.26 v40.39,40.51 | v54.74,42.16 54.74,41.27 53.19,39.73 53.19,29.31 52.71,28.83 52.71,26.29 52.83,26.16 52.83,17.65 53.85,16.64 53.85,14.35 54.99,13.21 60.83,13.21 61.85,12.19 69.98,12.19 72.01,10.16 78.61,10.16 v80.39,8.38 R4.1 C2.2
  Top 0.305: IC1.13 40.39,41.26
  Bottom 0.254: v40.39,40.51 44.7,40.51 45.34,41.15 51.69,41.15 52.71,42.16 v54.74,42.16 | v80.39,8.38 81.03,8.38 84.45,4.95 89.28,4.95 X10.94
FAULT_M2  (via drill 0.35)
  Top 0.254: IC2.13 40.39,33.64 v40.39,32.89 | v52.45,32.89 52.45,32.26 52.58,32.13 52.58,29.46 52.2,29.08 52.2,26.04 52.32,25.91 52.32,17.4 53.34,16.38 53.34,14.1 54.74,12.7 60.58,12.7 61.6,11.68 69.72,11.68 71.75,9.65 76.58,9.65 v77.85,8.38 R11.1 C7.2
  Bottom 0.254: v40.39,32.89 v52.45,32.89 | v77.85,8.38 78.74,7.49 81.15,7.49 84.2,4.44 87.25,4.44 X10.93
FAULT_M3  (via drill 0.35)
  Top 0.254: IC3.13 40.39,26.02 v40.39,25.27 | v51.56,24.89 51.56,24.77 51.82,24.51 51.82,17.14 52.83,16.13 52.83,13.84 54.48,12.19 60.33,12.19 61.34,11.18 69.47,11.18 71.5,9.14 74.55,9.14 v75.31,8.38 R18.1 C12.2 | 83.95,2.79 X10.84
  Bottom 0.254: v51.56,24.89 50.16,24.89 49.78,25.27 v40.39,25.27 | v75.31,8.38 76.71,6.99 80.9,6.99 83.95,3.94 X10.84
FAULT_M4  (via drill 0.35)
  Top 0.254: IC4.13 40.39,18.4 v40.39,17.65 | v52.07,15.88 52.07,13.84 54.23,11.68 60.07,11.68 61.09,10.67 69.21,10.67 71.5,8.38 v72.77,8.38 R25.1 C17.2
  Bottom 0.254: v40.39,17.65 44.83,17.65 45.59,18.42 48.64,18.42 49.53,17.53 50.42,17.53 v52.07,15.88 | X10.A7 68.71,4.32 v72.77,8.38
FAULT_M5  (via drill 0.35)
  Top 0.254: IC5.13 40.39,10.78 v40.39,10.03 | C22.2 R32.1 v70.23,8.38 70.23,8.89 68.96,10.16 60.83,10.16 60.2,10.8 v58.55,10.8
  Bottom 0.254: v40.39,10.03 44.83,10.03 45.59,10.8 46.61,10.8 46.86,11.05 57.79,11.05 58.04,10.8 v58.55,10.8 | v70.23,8.38 70.23,6.73 X10.A6
GND  (via drill 0.35)
  Top 0.254: C11.1 44.41,23.24 | C23.1 C3.1
  Top 0.305: C4.1 35.86,42.29 IC1.6 38.1,42.29 v38.35,42.55 | 38.61,42.29 IC1.17 | C9.1 35.86,34.67 IC2.6 38.1,34.67 v38.35,34.93 | IC2.17 38.81,34.42 | C14.1 35.86,27.05 IC3.6 38.1,27.05 v38.35,27.3 | C19.1 35.86,19.43 IC4.6 38.1,19.43 v38.35,19.69 | C24.1 35.86,11.81 IC5.6 38.1,11.81 v38.35,12.07
  Top 0.508: X1.1 22.2,40.81 22.23,40.77 v23.62,40.77
  Bottom 0.508: X10.GND X10.GND@1 44.83,1.14 46.86,1.14 49.02,3.3 v49.53,3.3 | X10.GND@13 v23.62,40.77
  other vias: 31.75,38.61 39.37,41.53 38.35,41.53 39.37,42.55 31.75,40.39 31.75,39.5 31.75,30.99 31.75,32.77 31.75,31.88 39.37,34.93 39.37,33.91 38.35,33.91 31.75,23.37 31.75,25.15 31.75,24.26 39.37,27.3 39.37,26.29 38.35,26.29 31.75,15.75 31.75,17.53 31.75,16.64 39.37,19.69 39.37,18.67 38.35,18.67 31.75,8.13 31.75,9.91 31.75,9.02 39.37,12.07 39.37,11.05 38.35,11.05 40.01,38.23 38.23,38.23 39.12,38.23 40.01,30.61 38.23,30.61 39.12,30.61 40.01,22.99 38.23,22.99 39.12,22.99 40.13,15.37 38.35,15.37 39.24,15.37 40.01,7.75 38.23,7.75 39.12,7.75 38.23,45.85 39.12,45.85 40.01,45.85 62.74,4.95 63.37,4.32 51.44,6.35 53.98,6.35 56.52,6.35 59.05,6.35 61.6,6.35 57.66,21.72 21.97,43.69 4.57,46.61 4.57,37.72 4.57,28.83 4.57,19.94 4.57,11.05 58.93,34.42 29.21,46.48 26.8,44.07 25.53,50.04 26.8,38.23 26.8,30.61 26.8,22.99 26.8,15.37 26.8,7.75 60.71,21.72 59.69,21.72 58.67,21.72 56.64,21.72 61.72,21.72 70.1,17.53 70.1,16.51 70.1,18.54 70.1,19.56 70.1,15.49 73.66,28.19 74.68,28.19 72.64,28.19 70.1,28.19 70.1,27.18 70.1,26.16 70.1,29.21 70.1,30.23 76.2,31.37 77.22,33.4 77.22,36.32 77.22,34.42 77.22,37.34 77.6,41.4 77.6,42.42 77.6,40.39 76.2,26.04 76.2,25.02 46.36,8.13 46.36,14.99 46.36,30.35 49.53,12.32 46.36,38.35
  pour Top (isolate 0.127, rank 3, no thermals): 0.13,53.47 101.73,53.47 101.73,0.13 0.13,0.13
  pour Bottom (isolate 0.127, rank 3, no thermals): 0.13,53.47 102.36,53.47 102.36,0.13 0.13,0.13
MAG_CS1  (via drill 0.35)
  Top 0.254: X3.6 10.87,43.23 11.68,42.42 11.68,34.42 v12.95,33.15
  Bottom 0.254: X10.54 v12.95,33.15
MAG_CS2  (via drill 0.35)
  Top 0.254: X4.6 10.87,34.09 v12.95,32
  Bottom 0.254: v12.95,32 16.89,28.07 X10.58
MAG_CS3  (via drill 0.35)
  Top 0.254: X5.6 10.87,25.83 11.68,25.02 v13.84,25.02
  Bottom 0.254: v13.84,25.02 16.38,25.02 16.89,25.53 X10.60
MAG_CS4  (via drill 0.35)
  Top 0.254: X6.6 10.87,22.31 11.55,22.99 v13.84,22.99
  Bottom 0.254: v13.84,22.99 X10.62
MAG_CS5  (via drill 0.35)
  Top 0.254: X7.6 10.87,19.51 12.32,20.96 v13.84,20.96
  Bottom 0.254: v13.84,20.96 16.26,20.96 16.76,20.45 X10.64
MAG_MISO  (via drill 0.35)
  Top 0.254: X3.4 8.37,48.13 | 8.37,48.13 X4.4 X5.4 X6.4 X7.4 | v8.38,49.91 8.38,48.14 8.37,48.13
  Bottom 0.254: v8.38,49.91 9.04,50.57 9.92,50.57 10.31,50.18 10.31,50.16 11.71,48.77 18.92,48.77 20.45,50.29 20.45,51.69 21.46,52.7 30.1,52.7 X10.12
MAG_MOSI  (via drill 0.35)
  Top 0.254: v7.11,49.91 v7.12,49.9 X3.3 X4.3 X5.3 X6.3 X7.3
  Bottom 0.254: X10.11 32.77,49.28 22.86,49.28 21.34,47.75 11.05,47.75 9.65,49.15 7.87,49.15 v7.11,49.91
MAG_SCK  (via drill 0.35)
  Top 0.254: X3.5 9.62,48.26 | 9.62,48.26 X4.5 X5.5 X6.5 X7.5 | v9.65,49.91 9.65,48.29 9.62,48.26
  Bottom 0.254: v9.65,49.91 11.3,48.26 21.08,48.26 22.99,50.16 22.99,51.69 23.49,52.2 28.07,52.2 X10.13
MISO
  Top 0.254: X2.4 X10.SPI1_CIPO
MOSI
  Top 0.254: X2.3 64.27,31.87 64.9,31.24 64.9,29.34 X10.SPI1_COPI
N$41  (via drill 0.35)
  Top 0.254: IC1.16 40.88,42.79 v41.4,43.31 | IC1.2 39.11,44.06 39.62,44.58 R2.2 41.4,44.54 v41.4,43.31 | v41.4,43.31 42.16,42.55 42.16,41.02 40.89,39.75 39.92,39.75 39.61,40.06 IC1.12 | R1.2 52.71,43.69 v53.09,43.31
  Top 0.305: 39.61,40.32 IC1.12
  Bottom 0.254: v53.09,43.31 51.18,43.31 50.04,42.16 45.34,42.16 44.96,42.55 42.16,42.55 v41.4,43.31
N$42  (via drill 0.35)
  Top 0.254: IC1.14 40.89,41.79 v41.4,41.27 | R3.1 v44.45,41.27 C1.2
  Bottom 0.254: v41.4,41.27 v44.45,41.27
N$43  (via drill 0.35)
  Top 0.254: R6.1 60.45,9.87 60.2,10.12 58.17,10.12 57.15,11.18 53.98,11.18 51.31,13.8 51.31,24.13 50.8,24.64 50.8,25.15 51.69,26.04 51.69,29.34 52.07,29.72 52.07,31.88 51.69,32.26 51.69,34.29 52.2,34.8 52.2,40.64 v52.96,41.4
  Top 0.305: IC1.8 37.36,40.54 | 37.36,40.54 v37.34,40.51 | IC1.9 37.36,40.54 | v37.34,43.56 38.09,43.56 IC1.4
  Top 0.813: R5.2 37.36,40.51 37.36,40.54
  Bottom 0.254: v52.96,41.4 52.2,40.64 45.59,40.64 44.96,40.01 41.02,40.01 40.77,39.75 40.01,39.75 39.24,40.51 v37.34,40.51
  Bottom 0.813: v37.34,40.51 v37.34,43.56
N$50
  Top 0.254: IC6.4 73.91,26 C31.1
N$51
  pour Top (isolate 0.127, rank 2, no thermals): 73.53,27.18 73.53,24.77 77.6,20.7 77.6,14.86 76.96,14.22 72.52,14.22 71.88,14.86 71.88,26.8 72.26,27.18
N$52  (via drill 0.35)
  Top 0.305: IC1.3 38.61,44.19 v38.23,44.58
  Bottom 0.813: J1.1 29.34,43.94 36.32,43.94 36.96,44.58 v38.23,44.58
N$53  (via drill 0.35)
  Top 0.305: IC1.7 36.83,41.79 v36.32,41.27
  Bottom 0.813: v36.32,41.27 34.93,42.67 29.34,42.67 J1.2
N$54  (via drill 0.35)
  Top 0.305: IC1.10 38.61,39.89 v38.23,39.5
  Bottom 0.813: v38.23,39.5 36.32,39.5 34.42,41.41 30.61,41.41 J1.3
N$58
  Top 0.254: D4.C R39.2
N$59
  Top 1.27: D3.A 67.07,47.64 65.89,46.46 X9.1
N$60
  Top 0.254: IC6.7 74.91,29.95 75.22,30.27 R38.2 R37.1
N$61
  Top 0.254: IC6.6 75.47,26.74 R36.2
N$66  (via drill 0.35)
  Top 0.254: IC2.16 40.88,35.17 v41.4,35.69 | IC2.2 39.11,36.45 39.62,36.96 R9.2 41.44,35.73 v41.4,35.69 | v41.4,35.69 42.16,34.93 42.16,33.4 40.89,32.13 39.92,32.13 39.61,32.44 IC2.12 | v52.45,33.91 52.45,34.04 52.71,34.29 52.71,40.01 53.98,41.27 R8.2
  Bottom 0.254: v52.45,33.91 51.94,33.4 47.75,33.4 46.23,34.93 42.16,34.93 v41.4,35.69
N$67  (via drill 0.35)
  Top 0.254: IC2.14 40.89,34.17 v41.4,33.66 | R10.1 v44.45,33.66 C6.2
  Bottom 0.254: v41.4,33.66 v44.45,33.66
N$70  (via drill 0.35)
  Top 0.254: R13.1 57.53,9.61 57.53,9.99 56.9,10.67 53.72,10.67 50.8,13.55 50.8,23.88 50.29,24.38 50.29,25.4 51.18,26.29 51.18,29.72 51.31,29.84 v51.31,30.35
  Top 0.305: IC2.4 37.36,35.92 v37.34,35.94 | IC2.9 38.09,32.89 v37.34,32.89 37.36,32.92 IC2.8
  Top 0.813: v37.34,32.89 36.07,31.62 R12.2
  Bottom 0.254: v37.34,32.89 39.24,32.89 40.01,32.13 40.77,32.13 41.02,32.38 51.56,32.38 52.09,31.85 52.09,31.14 v51.31,30.35
  Bottom 0.813: v37.34,35.94 v37.34,32.89
N$74  (via drill 0.35)
  Top 0.305: IC2.3 38.61,36.57 v38.23,36.96
  Bottom 0.813: J2.1 29.34,36.32 36.2,36.32 36.83,36.96 v38.23,36.96
N$75  (via drill 0.35)
  Top 0.305: IC2.7 36.71,34.17 v36.2,33.66
  Bottom 0.813: J2.2 29.34,35.05 34.8,35.05 v36.2,33.66
N$76  (via drill 0.35)
  Top 0.305: IC2.10 38.61,32.26 v38.23,31.88
  Bottom 0.813: J2.3 30.73,33.91 34.16,33.91 36.2,31.88 v38.23,31.88
N$92  (via drill 0.35)
  Top 0.254: IC3.16 40.88,27.55 v41.4,28.07 | IC3.2 39.11,28.83 39.62,29.34 R16.2 41.44,28.11 v41.4,28.07 | v41.4,28.07 42.16,27.3 42.16,25.78 40.89,24.51 39.92,24.51 39.61,24.82 IC3.12 | v53.47,26.67 53.47,28.7 53.72,28.96 53.72,39.5 55.5,41.27 55.5,42.58 55.25,42.84 R15.2
  Bottom 0.254: v41.4,28.07 42.16,27.3 49.15,27.3 49.78,26.67 v53.47,26.67
N$95  (via drill 0.35)
  Top 0.254: IC3.14 40.89,26.55 v41.4,26.04 | R17.1 v44.45,26.04 C11.2
  Bottom 0.254: v41.4,26.04 v44.45,26.04
N$99  (via drill 0.35)
  Top 0.254: v49.53,24.38 50.29,23.62 50.29,13.3 53.47,10.16 54.74,10.16 54.99,9.87 54.99,9.61 R20.1
  Top 0.305: IC3.4 37.36,28.3 v37.34,28.32 | IC3.9 37.36,25.3 | 37.36,25.3 v37.34,25.27 | IC3.8 37.36,25.3
  Top 0.813: v37.34,25.27 36.07,24 R19.2
  Bottom 0.254: v37.34,25.27 39.24,25.27 40.01,24.51 40.77,24.51 41.02,24.77 49.15,24.77 v49.53,24.38
  Bottom 0.813: v37.34,28.32 v37.34,25.27
N$102  (1 unrouted)
N$105  (via drill 0.35)
  Top 0.305: IC3.3 38.61,28.95 v38.23,29.34
  Bottom 0.813: J3.1 29.34,28.7 36.2,28.7 36.83,29.34 v38.23,29.34
N$106  (via drill 0.35)
  Top 0.305: IC3.7 36.71,26.55 v36.2,26.04
  Bottom 0.813: J3.2 29.34,27.43 34.8,27.43 v36.2,26.04
N$107  (via drill 0.35)
  Top 0.305: IC3.10 38.61,24.64 v38.23,24.26
  Bottom 0.813: J3.3 30.73,26.29 34.16,26.29 36.2,24.26 v38.23,24.26
N$110  (via drill 0.35)
  Top 0.254: IC4.16 40.88,19.93 v41.4,20.45 | IC4.2 39.11,21.21 39.62,21.72 R23.2 41.4,21.68 v41.4,20.45 | v41.4,20.45 42.16,19.69 42.16,18.16 40.89,16.89 40.05,16.89 39.61,17.32 IC4.12 | v53.59,18.03 53.59,18.67 53.34,18.92 53.34,25.53 54.23,26.42 54.23,39.24 56.52,41.53 R22.2
  Bottom 0.254: v53.59,18.03 49.66,18.03 47.75,19.94 46.86,19.94 46.61,19.69 42.16,19.69 v41.4,20.45
N$111  (via drill 0.35)
  Top 0.254: IC4.14 40.89,18.93 v41.4,18.42 | R24.1 v44.45,18.42 C16.2
  Bottom 0.254: v41.4,18.42 v44.45,18.42
N$114  (via drill 0.35)
  Top 0.254: v49.53,15.49 49.53,13.34 52.83,10.03 R27.1
  Top 0.305: IC4.4 37.36,20.68 v37.34,20.7 | IC4.9 37.36,17.68 | 37.36,17.68 v37.34,17.65 | 37.36,17.68 IC4.8
  Top 0.813: v37.34,17.65 36.07,16.38 R26.2
  Bottom 0.254: v37.34,17.65 39.37,17.65 40.13,16.89 40.77,16.89 41.02,17.14 45.09,17.14 45.85,17.91 48.51,17.91 49.53,16.89 v49.53,15.49
  Bottom 0.813: v37.34,20.7 v37.34,17.65
N$118  (via drill 0.35)
  Top 0.305: IC4.3 38.61,21.33 v38.23,21.72
  Bottom 0.813: J4.1 29.34,21.08 36.2,21.08 36.83,21.72 v38.23,21.72
N$119  (via drill 0.35)
  Top 0.305: IC4.7 36.71,18.93 v36.2,18.42
  Bottom 0.813: J4.2 29.34,19.81 34.8,19.81 v36.2,18.42
N$120  (via drill 0.35)
  Top 0.305: IC4.10 38.61,16.89 v38.35,16.64
  Bottom 0.813: J4.3 30.73,18.67 34.16,18.67 36.2,16.64 v38.35,16.64
N$123  (via drill 0.35)
  Top 0.254: IC5.16 40.88,12.31 v41.4,12.83 | IC5.2 39.11,13.59 39.62,14.1 R30.2 41.44,12.87 v41.4,12.83 | v41.4,12.83 42.16,12.07 42.16,10.54 40.89,9.27 39.92,9.27 39.61,9.58 IC5.12 | 54.36,14.99 | v55.88,13.97 54.99,13.97 54.36,14.61 54.36,14.99 | R29.2 57.79,42.04 54.74,38.99 54.74,26.16 53.85,25.27 53.85,19.18 54.36,18.67 54.36,14.99
  Bottom 0.254: v55.88,13.97 53.47,11.56 47.88,11.56 46.99,12.45 42.42,12.45 42.04,12.83 v41.4,12.83
N$124  (via drill 0.35)
  Top 0.254: IC5.14 40.89,11.31 v41.4,10.8 | R31.1 v44.45,10.8 C21.2
  Bottom 0.254: v41.4,10.8 v44.45,10.8
N$127  (via drill 0.35)
  Top 0.254: R34.1 v50.29,10.29
  Top 0.305: IC5.4 37.36,13.06 v37.34,13.08 | IC5.9 37.36,10.06 | 37.36,10.06 v37.34,10.03 | IC5.8 37.36,10.06
  Top 0.813: v37.34,10.03 36.07,8.76 R33.2
  Bottom 0.254: v37.34,10.03 39.24,10.03 40.01,9.27 40.77,9.27 41.02,9.52 45.09,9.52 45.85,10.29 46.86,10.29 47.12,10.54 49.53,10.54 49.78,10.29 v50.29,10.29
  Bottom 0.813: v37.34,13.08 v37.34,10.03
N$131  (via drill 0.35)
  Top 0.305: IC5.3 38.61,13.84 v38.35,14.1
  Bottom 0.813: J5.1 29.34,13.46 36.2,13.46 36.83,14.1 v38.35,14.1
N$132  (via drill 0.35)
  Top 0.305: IC5.7 36.71,11.31 v36.2,10.8
  Bottom 0.813: J5.2 29.34,12.19 34.8,12.19 v36.2,10.8
N$133  (via drill 0.35)
  Top 0.305: IC5.10 38.61,9.4 v38.23,9.02
  Bottom 0.813: J5.3 30.73,11.05 34.16,11.05 36.2,9.02 v38.23,9.02
RX1  (via drill 0.35)
  Top 0.254: v89.41,42.42 X12.2
  Bottom 0.254: X10.19 82.8,49.53 84.58,49.53 89.41,44.7 v89.41,42.42
RX2  (via drill 0.39)
  Top 0.254: v88.01,31.24 86.16,31.24 X13.2
  Bottom 0.254: X10.17 78.87,48.39 84.2,48.39 87.88,44.7 87.88,34.04 88.77,33.15 88.77,32 v88.01,31.24
SCK
  Top 0.254: X2.5 62.33,29.37 X10.SPI1_SCK
SCL  (via drill 0.35)
  Top 0.254: X11.3 90.67,21.33 v90.68,21.34
  Bottom 0.254: X10.21 86.49,49.15 90.68,44.96 v90.68,21.34
SCL1  (via drill 0.35)
  Top 0.254: X10.101 20.2,49.9 20.2,44.11 19.7,43.6 X1.3 19.7,39.76 19.43,39.5 17.65,39.5 17.27,39.12 v17.27,36.96
  Bottom 0.254: X10.101@1 v17.27,36.96
SDA  (via drill 0.35)
  Top 0.254: X11.2 89.91,20.08 v89.92,20.07
  Bottom 0.254: X10.20 90.17,44.7 90.17,22.35 89.92,22.1 v89.92,20.07
SDA1  (via drill 0.35)
  Top 0.254: X1.2 20.95,41.95 21.07,42.08 | X1.2 20.95,50.16 X10.102 | X1.2 20.95,39.76 21.21,39.5 23.24,39.5 23.62,39.12 v23.62,36.96
  Bottom 0.254: X10.102@1 v23.62,36.96
SENSE_M1  (via drill 0.35)
  Top 0.254: R7.1 R6.2 C3.2 61.18,5.33 v61.6,5.33
  Bottom 0.254: v61.6,5.33 61.6,4.83 63.63,2.79 X10.A5
SENSE_M2  (via drill 0.35)
  Top 0.254: R14.1 R13.2 C8.2 58.64,5.33 v59.05,5.33
  Bottom 0.254: X10.A4 59.05,4.7 v59.05,5.33
SENSE_M3  (via drill 0.35)
  Top 0.254: 55.37,6.1 R20.2 R21.1 | 55.37,6.1 C13.2 | v56.52,5.3 56.17,5.3 55.37,6.1
  Bottom 0.254: v56.52,5.3 56.52,4.66 58.51,2.67 X10.A3
SENSE_M4  (via drill 0.35)
  Top 0.254: R28.1 R27.2 C18.2 53.55,5.33 v53.98,5.33
  Bottom 0.254: v53.98,5.33 53.47,4.83 X10.A1
SENSE_M5  (via drill 0.35)
  Top 0.254: R35.1 R34.2 C23.2 51.02,5.33 v51.44,5.33
  Bottom 0.254: v51.44,5.33 50.93,4.83 X10.A0
TX1  (via drill 0.35)
  Top 0.254: X12.3 v88.64,43.68 v88.65,43.69
  Bottom 0.254: v88.65,43.69 88.65,44.7 84.33,49.02 80.77,49.02 X10.18
TX2  (via drill 0.39)
  Top 0.254: v88.01,32.51 X13.3
  Bottom 0.254: X10.16 76.83,47.88 83.95,47.88 87.38,44.45 87.38,33.78 88.01,33.15 v88.01,32.51
U_M1  (via drill 0.35)
  Top 0.254: IC1.1 40.36,43.54 | X10.10 39.24,48.64 43.31,48.64 46.1,45.85 46.1,44.32 v45.72,43.94
  Top 0.305: 40.36,43.54 v40.39,43.56
  Bottom 0.254: v40.39,43.56 40.89,44.07 41.66,44.07 42.67,43.05 44.83,43.05 v45.72,43.94
U_M2  (via drill 0.35, 0.39)
  Top 0.254: IC2.1 40.36,35.92 v40.39,35.94 | v50.93,35.31 50.65,35.03 50.65,26.52 48.77,24.64 48.77,22.73 49.28,22.23 49.28,17.02 48.26,16 48.26,2.67 49.4,1.52 v49.4,1.02
  Bottom 0.254: v50.93,35.31 49.53,33.91 48.01,33.91 46.48,35.43 42.67,35.43 41.66,36.45 40.89,36.45 v40.39,35.94 | X10.40 95.38,24.26 97.28,24.26 98.42,23.11 98.42,6.73 97.54,5.84 94.61,5.84 93.6,4.83 93.6,1.78 92.58,0.76 50.29,0.76 50.04,1.02 v49.4,1.02
U_M3  (via drill 0.35)
  Top 0.254: IC3.1 40.36,28.3 v40.39,28.32 | X10.7 45.97,50.93 48.64,48.26 48.64,40.77 49.15,40.26 49.15,37.72 48.13,36.7 48.13,28.7 v47.5,28.07
  Bottom 0.254: v40.39,28.32 40.89,28.83 41.66,28.83 42.67,27.81 46.74,27.81 46.99,28.07 v47.5,28.07
U_M4  (via drill 0.35)
  Top 0.254: IC4.1 40.36,20.68 v40.39,20.7 | X10.6 48.39,49.21 49.15,48.45 49.15,41.02 49.66,40.51 49.66,37.47 48.64,36.45 48.64,28.07 47.24,26.67 47.24,21.97 47.5,21.72 v47.5,20.7
  Bottom 0.254: v47.5,20.7 46.86,20.7 46.36,20.19 42.67,20.19 41.66,21.21 40.89,21.21 v40.39,20.7
U_M5  (via drill 0.35)
  Top 0.254: IC5.1 40.36,13.06 v40.39,13.08 | X10.4 51.18,48.64 51.18,43.43 51.69,42.93 51.69,41.66 51.18,41.15 51.18,36.7 50.16,35.69 50.16,26.8 48.26,24.89 48.26,22.48 48.77,21.97 48.77,17.27 47.75,16.26 47.75,13.84 47.5,13.59 v47.5,12.95
  Bottom 0.254: v47.5,12.95 42.67,12.95 42.04,13.59 40.89,13.59 v40.39,13.08
V_M1  (via drill 0.35)
  Top 0.254: IC1.15 v41.4,42.29 | X10.1 59.82,52.2 52.83,52.2 52.2,51.56 52.2,50.42 50.67,48.9 50.67,43.18 50.93,42.93 v50.93,42.04
  Top 0.305: v41.4,42.29
  Bottom 0.254: v50.93,42.04 50.55,41.66 45.09,41.66 44.7,42.04 41.66,42.04 v41.4,42.29
V_M2  (via drill 0.35, 0.39)
  Top 0.254: IC2.15 v41.4,34.67 | v45.85,47.12 46.61,46.36 46.61,39.12 47.12,38.61 47.12,37.97 46.61,37.47 46.61,34.42 46.36,34.16 v46.36,33.66 | v17.65,44.07 17.65,42.42 15.75,40.51 v15.75,31.75
  Bottom 0.254: v46.36,33.66 45.59,34.42 41.66,34.42 v41.4,34.67 | v45.85,47.12 46.61,47.88 46.61,48.51 46.23,48.9 45.47,48.9 45.34,48.77 23.11,48.77 21.59,47.24 20.83,47.24 v17.65,44.07 | v15.75,31.75 16.89,30.61 X10.56
V_M3  (via drill 0.35)
  Top 0.254: IC3.15 v41.4,27.05 | X10.5 50.93,50.67 50.16,49.91 50.16,41.53 50.67,41.02 50.67,36.96 49.66,35.94 49.66,27.3 v48.9,26.54
  Bottom 0.254: v48.9,26.54 48.39,26.54 48.13,26.8 41.66,26.8 v41.4,27.05
V_M4  (via drill 0.35)
  Top 0.254: IC4.15 v41.4,19.43 | v47.24,19.18 46.74,19.69 46.74,28.45 47.62,29.34 47.62,36.96 48.64,37.97 48.64,40.01 48.13,40.51 48.13,48.01 46.48,49.66 43.31,49.66 X10.8
  Bottom 0.254: v47.24,19.18 41.66,19.18 v41.4,19.43
V_M5  (via drill 0.35)
  Top 0.254: IC5.15 v41.4,11.81 | X10.15 69.47,52.7 50.8,52.7 49.66,51.56 49.66,41.27 50.16,40.77 50.16,37.21 49.15,36.2 49.15,27.81 47.75,26.42 47.75,22.23 48.26,21.72 48.26,17.53 47.24,16.51 47.24,14.1 46.36,13.21 v46.36,11.68
  Bottom 0.254: v46.36,11.68 44.32,11.68 43.94,11.3 41.91,11.3 v41.4,11.81
VIN
  pour Top (isolate 0.127, rank 2, no thermals): 73.91,29.21 74.06,43.29 73.54,43.81 70.87,43.81 69.6,42.55 69.6,32.64 71.63,30.61 71.63,29.84 72.26,29.21
VS  (via drill 0.35)  (1 unrouted)
  Top 0.254: R37.2 v77.34,26.29 | C27.1 C28.1 | C28.1 L1.2 | v60.96,16.13 60.96,17.27 C28.1 | D4.A 33.53,45.61 C5.+
  Top 0.305: IC1.5 37.06,42.79 C4.2 | IC2.5 37.06,35.17 C9.2 | IC3.5 37.06,27.55 C14.2 | IC4.5 37.06,19.93 C19.2 | IC5.5 37.06,12.31 C24.2
  Top 0.813: C5.+ 35.67,44.17 C4.2 | C9.2 33.54,36.54 C25.+ | C14.2 33.54,28.92 C20.+ | C19.2 33.54,21.3 C15.+ | C24.2 33.54,13.68 C10.+
  Top 1.27: C5.+ 31.22,44.17 30.48,43.43 30.48,36.58 | 30.48,13.72 30.52,13.68 33.54,13.68 | 30.48,36.58 30.48,28.96 | 30.48,28.96 30.48,21.34 | 30.48,21.34 30.48,13.72 | C15.+ 30.5,21.31 30.48,21.34 | C20.+ 30.5,28.93 30.48,28.96 | C25.+ 30.5,36.55 30.48,36.58 | 30.48,13.72 v30.48,5.72 | L1.2
  Bottom 0.254: v77.34,26.29 77.85,25.78 77.85,14.61 76.83,13.59 64.01,13.59 62.1,15.49 61.09,15.49 60.96,15.62 v60.96,16.13
  Bottom 1.27: v30.48,5.72 45.85,5.72 45.85,5.46 | 45.85,5.46 X10.VIN | 45.85,5.46 48.64,8.25 59.56,8.25 60.96,9.65 v60.96,16.13
  other vias: 60.96,15.11
  pour Top (isolate 0.127, rank 2, no thermals): 66.55,14.61 67.06,15.11 67.06,19.69 66.29,20.45 57.79,20.45 56.26,18.92 56.26,16.89 58.55,14.61
W5500_CS
  Top 0.254: X2.6 56.86,28.12 55.25,29.73 55.25,38.73 58.67,42.16 58.67,46.86 60.33,48.51 64.01,48.51 65.02,49.53 71.75,49.53 72.52,50.29 72.52,51.56 73.15,52.2 84.58,52.2 85.22,51.56 85.22,48.13 87.5,45.85 91.57,45.85 X10.22
W_M1  (via drill 0.35)
  Top 0.254: IC1.11 39.11,39.63 v39.24,39.5 | v45.85,48.13 | v45.85,48.13 47.12,46.86 47.12,39.75 v47.37,39.5
  Bottom 0.254: X10.57 24.13,30.61 24.89,31.37 24.89,45.85 27.3,48.26 45.72,48.26 v45.85,48.13 | v47.37,39.5 41.28,39.5 41.02,39.24 39.62,39.24 39.37,39.5 v39.24,39.5
W_M2  (via drill 0.35)
  Top 0.254: IC2.11 39.11,32.01 v39.24,31.88 | v51.31,31.37 51.31,31.88 51.18,32 51.18,34.54 51.69,35.05 51.69,40.89 52.2,41.4 52.2,43.18 51.69,43.69 51.69,48.39 52.96,49.66 54.74,49.66 X10.3
  Bottom 0.254: v39.24,31.88 39.37,31.88 39.62,31.62 41.02,31.62 41.28,31.88 50.8,31.88 v51.31,31.37
W_M3  (via drill 0.35)
  Top 0.254: IC3.11 39.11,24.39 v39.24,24.26 | X10.A2 54.74,1.4 50.29,1.4 48.77,2.92 48.77,15.75 49.78,16.76 49.78,22.48 49.53,22.73 v49.53,23.24
  Bottom 0.254: v39.24,24.26 39.37,24.26 39.62,24 41.02,24 41.28,24.26 48.51,24.26 v49.53,23.24
W_M4  (via drill 0.35)
  Top 0.254: IC4.11 39.11,16.89 v39.37,16.64 | v46.36,17.14 46.36,17.65 46.23,17.78 46.23,28.7 47.12,29.59 47.12,37.21 48.13,38.23 48.13,39.75 47.62,40.26 47.62,47.5 45.97,49.15 41.28,49.15 X10.9
  Bottom 0.254: v39.37,16.64 39.5,16.64 39.75,16.38 45.59,16.38 v46.36,17.14
W_M5  (via drill 0.35)
  Top 0.254: IC5.11 39.11,9.15 v39.24,9.02 | v47.37,9.78 47.75,9.4 47.75,2.41 48.26,1.91 v48.26,1.27
  Bottom 0.254: X10.48 95.38,14.1 97.28,14.1 97.92,13.46 97.92,6.99 97.28,6.35 94.36,6.35 93.09,5.08 93.09,2.03 92.33,1.27 50.42,1.27 49.91,1.78 48.77,1.78 v48.26,1.27 | v39.24,9.02 39.5,8.76 41.02,8.76 41.28,9.02 45.34,9.02 46.1,9.78 v47.37,9.78

### Text on the board
tNames: Th.Reufer | POWER | I2C4 | 3V3 / SCL / SDA / GND | GND / 3V3 / MOSI / MISO / SCK / D18 | M5 / 4 / 15 / 48 | 0V + | 0V + | USART2/+5V | MAG M1 | M1 / W V U | M4 / 6 / 8 / 9 | DC in / 12..24V | M3 / 7 / 5 / A2 | M5 / 64 | M2 / W V U | M2 / 40 / 56 / 3 | 5V / TX1 / RX1 / GND | MAG M2 | M4 / 62 | M1 / 10 / 1 / 57 | USART4 | U / V / W | M3 / 60 | M5 / 14 / A6 / A0 | M2 / 58 | M3 / W V U | 3V3 / TX2 / RX2 / GND | MAG M3 | M4 / 0 / A7 / A1 | M1 / 54 | M3 / 2 / 84 / A3 | SPI5 / CS | I2C2 | M4 / W V U | M2 / 61 / 93 / A4 | 3V3 / SCL / SDA / GND | M1 / 59 / 94 / A5 | MAG M4 | M5 / W V U | ENA / FAULT / SENSE | D51 / D52 / D53 / GND | GPIO | MAG M5 | GPIO | GigaFOC | P1B | GND / 3V3 / MOSI / MISO / SCK / CS | GND / D66 / D67 / D65